# Altium schematic sheet ti84_usbc.SchDoc
size 297 x 209 mm
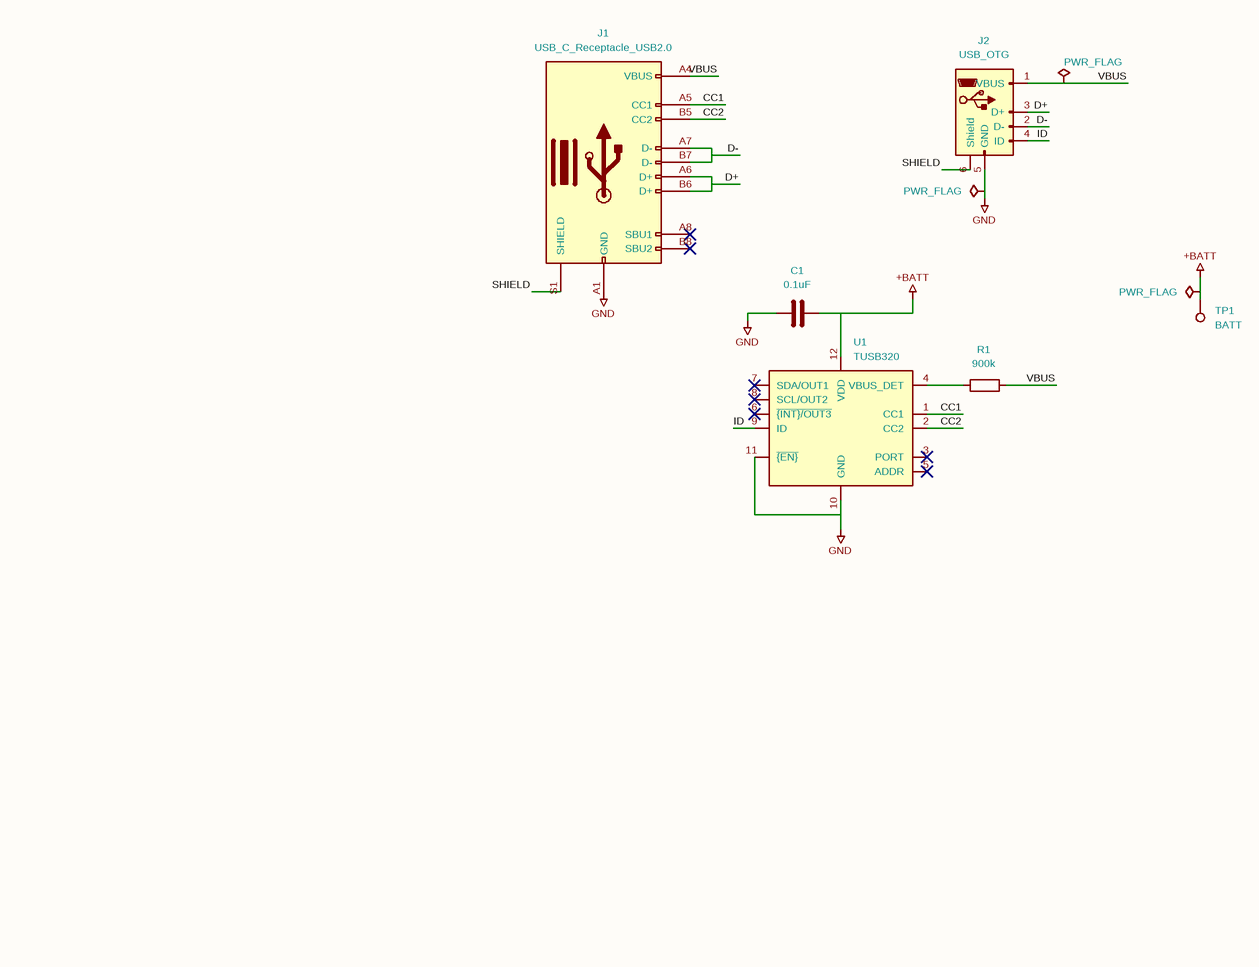
[diagram p0: ti84_usbc.SchDoc]

## Parts
#FLG01  PWR_FLAG  (graphical)
#FLG02  PWR_FLAG  (graphical)
#FLG03  PWR_FLAG  (graphical)
C1  0.1uF  [C_0402_1005Metric]
J1  USB_C_Receptacle_USB2.0  [USB_C_Receptacle_GCT_USB4105-xx-A_16P_TopMnt_Horizontal]
J2  USB_OTG  [ti84_mini_usb]
R1  900k  [R_0402_1005Metric]
TP1  BATT  [TestPoint_Pad_1.0x1.0mm]
U1  TUSB320  [IC_TUSB320IRWBR]

## Nets
+BATT: #FLG03.1(pwr) C1.2 TP1.1 U1.12(VDD)
GND: #FLG01.1(pwr) C1.1 J1.A1(GND) J2.5(GND) U1.10(GND) U1.11(~{{EN}})
CC1: J1.A5(CC1) U1.1(CC1)
CC2: J1.B5(CC2) U1.2(CC2)
D+: J1.A6(D+) J1.B6(D+) J2.3(D+)
D-: J1.A7(D-) J1.B7(D-) J2.2(D-)
ID: J2.4(ID) U1.9(ID)
SHIELD: J1.S1(SHIELD) J2.6(Shield)
VBUS: #FLG02.1(pwr) J1.A4(VBUS) J2.1(VBUS) R1.2
NetR1_1: R1.1 U1.4(VBUS_DET)

Not connected (* = marked no-connect by the designer): J1 A8(SBU1)* A9(VBUS) A12(GND) B1(GND) B4(VBUS) B8(SBU2)* B9(VBUS) B12(GND); U1 3(PORT)* 5(ADDR)* 6(~{{INT}/OUT3})* 7(SDA/OUT1)* 8(SCL/OUT2)*

## Notes on the sheet
- 1
- 2
- 3
- 4
- 5
- 6
- A
- B
- C
- D
- Title:
- File: ti84_usbc.kicad_sch
- Sheet: /
- KiCad E.D.A.  kicad (5.1.4)-1
- Size: A4
- Date:
- Rev:
- Id: 1/1

## Library data of the parts
C1 = C: Value: 0.1uF; Footprint: Capacitor_SMD:C_0402_1005Metric
R1 = R: Value: 900k; Footprint: Resistor_SMD:R_0402_1005Metric
TP1 = TestPoint: Value: BATT; Footprint: TestPoint:TestPoint_Pad_1.0x1.0mm
#FLG01 #FLG02 #FLG03 = PWR_FLAG: Value: PWR_FLAG
J1 = USB_C_Receptacle_USB2.0: Value: USB_C_Receptacle_USB2.0; Footprint: Connector_USB:USB_C_Receptacle_GCT_USB4105-xx-A_16P_TopMnt_Horizontal
J2 = USB_OTG: Value: USB_OTG; Footprint: ti84_mini_usb:ti84_mini_usb
U1 = TUSB320: Value: TUSB320; Footprint: ti84_mini_usb:IC_TUSB320IRWBR